# EAGLE design power_stub (EAGLE 7.2.0)
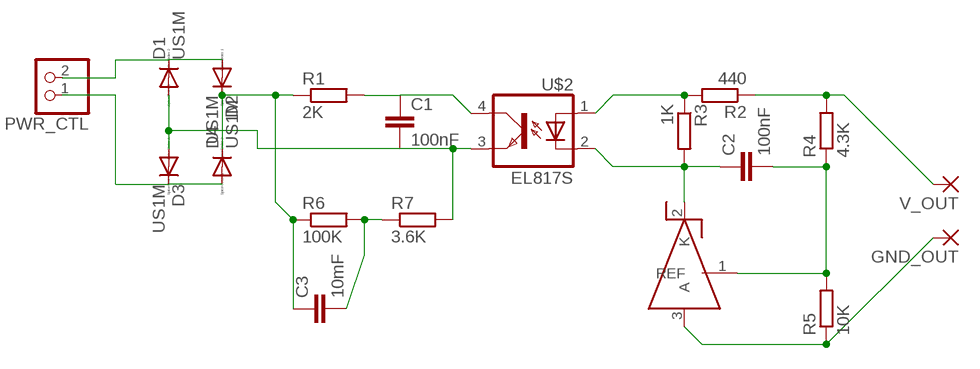
[diagram p0: schematic, sheet 1]

## Parts
C1  100nF  C-EUC0805  [C0805]
C2  100nF  C-EUC0805  [C0805]
C3  10mF  C-EUC0805  [C0805]
D1  US1M  DIODE-DO-214AC  [DO-214AC]
D2  US1M  DIODE-DO-214AC  [DO-214AC]
D3  US1M  DIODE-DO-214AC  [DO-214AC]
D4  US1M  DIODE-DO-214AC  [DO-214AC]
GND_OUT  SMD5  [SMD2,54-5,08]
PWR_CTL  PINHD-1X2/90  [1X02/90]
R1  2K  R-EU_R0805  [R0805]
R2  440  R-EU_R0805  [R0805]
R3  1K  R-EU_R0805  [R0805]
R4  4.3K  R-EU_R0805  [R0805]
R5  10K  R-EU_R0805  [R0805]
R6  100K  R-EU_R0805  [R0805]
R7  3.6K  R-EU_R0805  [R0805]
U$1  TL431AIDBZR  [SOT23]
U$2  EL817S  [SMD4_L]
V_OUT  SMD5  [SMD2,54-5,08]

## Nets
GND: GND_OUT.1(P) R5.1 U$1.3(A)
GND_HI: C1.2 D1.A D3.A R7.2 U$2.3(EMIT)
N$2: D1.C D2.A PWR_CTL.2
N$3: C1.1 R1.2 U$2.4(COL)
N$5: D3.C D4.A PWR_CTL.1
N$7: C2.1 R3.2 U$1.2(K) U$2.2(C)
N$8: R2.1 R4.2 V_OUT.1(P)
N$9: C2.2 R4.1 R5.2 U$1.1(REF)
N$10: C3.2 R6.2 R7.1
N$11: R2.2 R3.1 U$2.1(A)
V_HI: C3.1 D2.C D4.C R1.1 R6.1

## Library data of the parts
C1 C3 = rcl:C-EU: CAPACITOR, European symbol
C2 = resistor:C-EU: CAPACITOR, European symbol
D1-D4 = diode:DIODE-: DIODE
GND_OUT V_OUT = wirepad:SMD5: SMD PAD
PWR_CTL = pinhead:PINHD-1X2: PIN HEADER
R1 R6 R7 = rcl:R-EU_: RESISTOR, European symbol
R2-R5 = resistor:R-EU_: RESISTOR, European symbol
U$1 = my_mixed:TL431AIDBZR
U$2 = my_mixed:EL817S

## Board
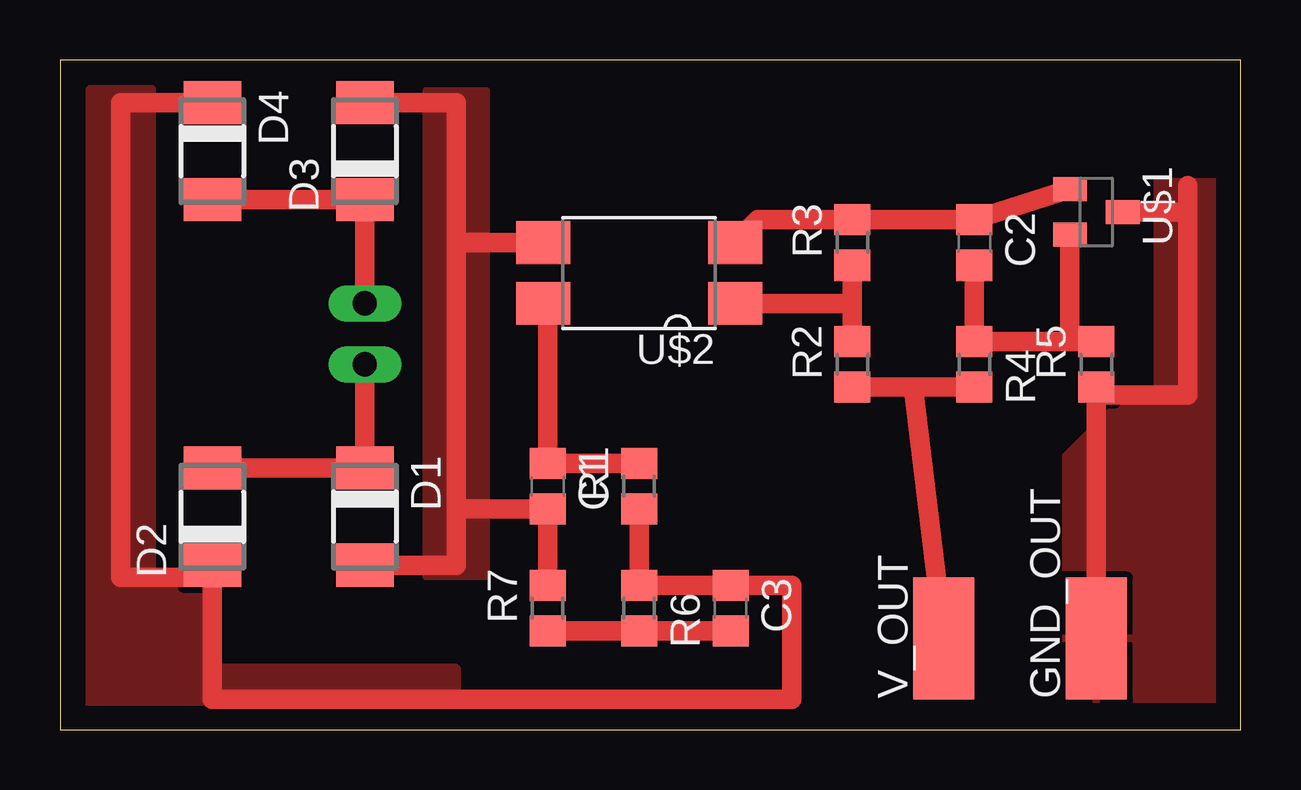
[diagram p1: board, top side]
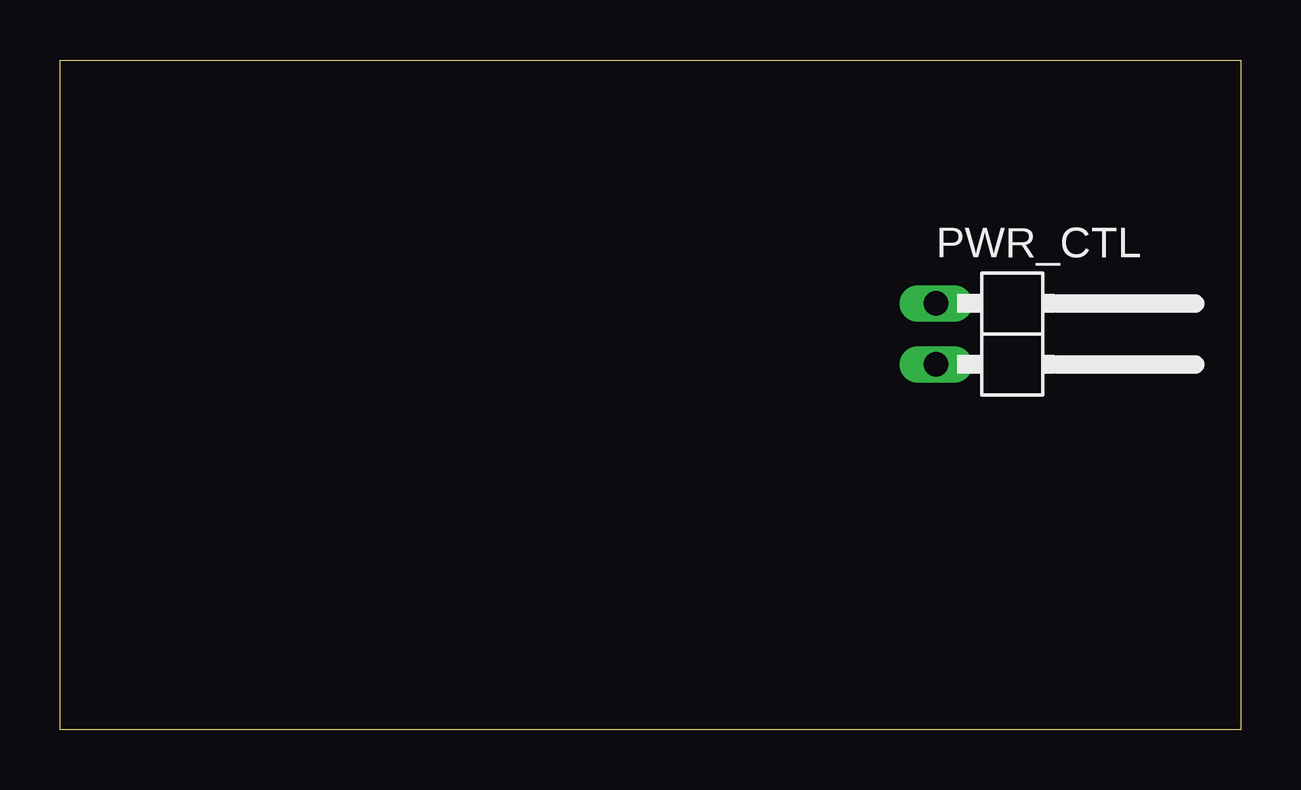
[diagram p2: board, bottom side, seen from below]

Size 49.2 x 27.93 mm. Coordinates in mm from the lower left corner, seen from the top.
Outline: 0,0 49.2,0 49.2,27.93 0,27.93 0,0
Copper layers (1*16): Top 0.035mm / dielectric 1.5mm / Bottom 0.035mm
Design rules "default": minimum track width 10mil, minimum drill 24mil, track to track 8mil, track to pad 8mil, pad to pad 8mil, via to via 8mil, smd to smd 8mil, copper to edge 40mil, drill to drill 8mil, minimum pad ring 10mil, minimum via ring 8mil, stop-mask expansion 4mil, vias tented up to drill 0mil, thermal gap 10mil

### Footprints (pad centres in the part's own frame; a part is rotated, then mirrored left to right if it is on the bottom)
C0805 = smd 1.3 x 1.5: 1 -0.95,0; 2 0.95,0
DO-214AC = smd 1.8 x 2.4: A 2.025,0; C -2.025,0
SMD2,54-5,08 = smd 2.54 x 5.08: 1 0,0
1X02/90 = drill 1.016 long: 1 -1.27,-3.81; 2 1.27,-3.81
R0805 = smd 1.3 x 1.5: 1 -0.95,0; 2 0.95,0
SOT23 = smd 1 x 1.4: 1 0.95,-1.1; 2 -0.95,-1.1; 3 0,1.1
SMD4_L = smd 1.78 x 2.25: 1 0,-4; 2 2.54,-4; 3 2.54,4; 4 0,4

### Placement (x,y rotation side)
C1  20.32,10.16 270 top
C2  38.1,20.32 270 top
C3  27.94,5.08 270 top
D1  12.7,8.89 270 top
D2  6.35,8.89 90 top
D3  12.7,24.13 90 top
D4  6.35,24.13 270 top
GND_OUT  43.18,3.81 0 top
PWR_CTL  8.89,16.51 270 bottom
R1  24.13,10.16 90 top
R2  33.02,15.24 90 top
R3  33.02,20.32 90 top
R4  38.1,15.24 270 top
R5  43.18,15.24 90 top
R6  24.13,5.08 270 top
R7  20.32,5.08 90 top
U$1  43.18,21.59 270 top
U$2  24.13,17.78 90 top
V_OUT  36.83,3.81 0 top

### Tracks (layer width: path | path; a pad name or v marks a point on that pad's centre or on a via)
GND
  Top 0.813: GND_OUT.1 R5.1 43.18,13.97 46.99,13.97 46.99,21.59 | 46.99,22.69 46.99,21.59 | U$1.3 46.99,21.59
  pour Top: 41.91,1.27 41.91,11.43 44.45,13.97 45.72,13.97 45.72,22.86 48.26,22.86 48.26,1.27
GND_HI
  Top 0.813: 16.51,9.21 16.51,6.87 D1.A 12.38,6.87 | 16.51,9.21 16.51,20.32 | 16.51,20.32 16.51,26.16 D3.A | 16.51,9.21 C1.2 R7.2 | U$2.3 16.51,20.32
  pour Top: 15.24,6.35 15.24,26.67 17.78,26.67 17.78,6.35
N$2
  Top 0.813: D2.A D1.C PWR_CTL.2
N$3
  Top 0.813: R1.2 C1.1 20.32,17.78 U$2.4
N$5
  Top 0.813: PWR_CTL.1 D3.C D4.A
N$7
  Top 0.813: U$1.2 C2.1 R3.2 29.08,21.27 U$2.2
N$8
  Top 0.254: 38.15,14.17 R4.2
  Top 0.813: R2.1 35.56,14.29 | 35.56,14.29 R4.2 | V_OUT.1 35.56,14.29
N$9
  Top 0.813: C2.2 R4.1 41.91,16.19 42.08,16.19 | 42.08,16.19 R5.2 | U$1.1 42.08,16.19
N$10
  Top 0.813: R7.1 R6.2 C3.2
N$11
  Top 0.813: R2.2 33.02,17.78 | 33.02,17.78 R3.1 | U$2.1 33.02,17.78
V_HI
  Top 0.813: D4.C 2.54,26.16 2.54,6.35 6.35,6.35 | 6.35,6.35 D2.C | R1.1 R6.1 C3.1 30.48,6.03 30.48,1.27 6.35,1.27 6.35,6.35
  pour Top: 3.81,26.67 1.27,26.67 1.27,0 16.51,0 16.51,2.54 6.35,2.54 6.35,6.35 3.81,6.35